# Altium schematic sheet TESTBAG.SchDoc: Automatic Test Bag PCB
size 420 x 297 mm; Date: 26/05/2566; ApprovedBy: <?>; CheckedBy: <?>; CompanyName: ISON IMPORT-EXPORT COMPANY LIMITED; DrawnBy: KANTAPIT SRIVERAPOL; DocumentNumber: 1; Revision: D1; SheetNumber: 1; SheetTotal: 2; Size: A3; ISON_ModDesc1: Change PCB layout; ISON_ModDesc2: Fixed PCB Layout; ISON_Model: <?>; Time: 14.21
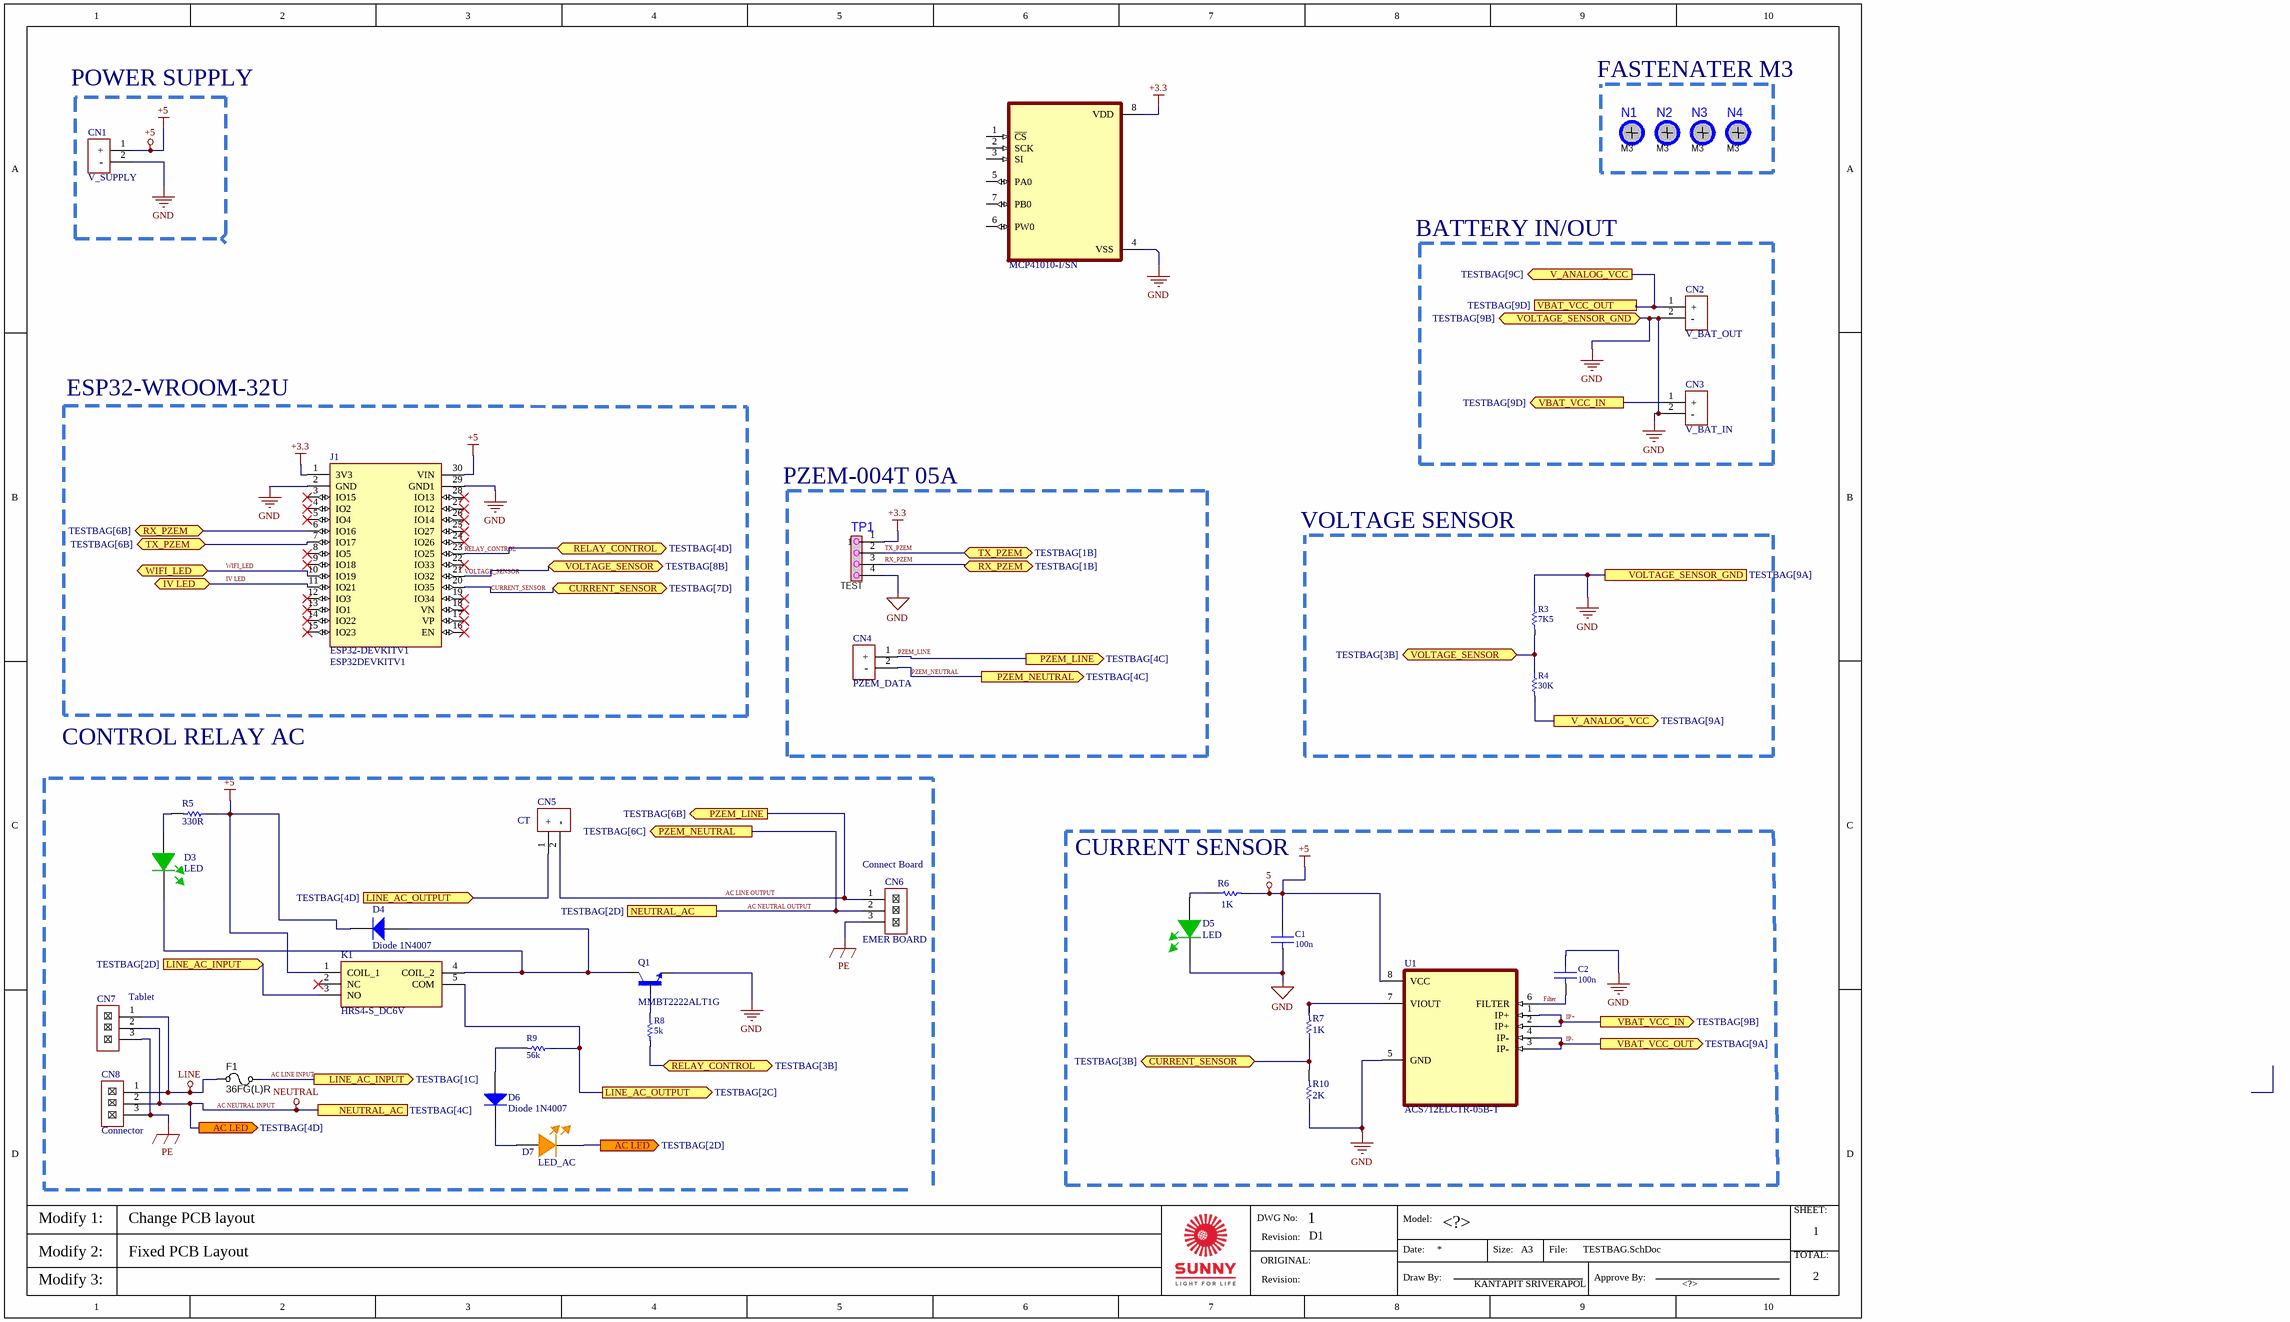
[diagram p0: TESTBAG.SchDoc]

## Parts
?  MCP41010-I/SN  [SOIC127P599X175-8N]
C1  100n  [CAPC2012X135N]
C2  100n  [CAPC2012X135N]
CN1  V_SUPPLY  [Header 2 pin molex]
CN2  V_BAT_OUT  [Header 2 pin molex]
CN3  V_BAT_IN  [Header 2 pin molex]
CN4  PZEM_DATA  [Header 2 pin molex]
CN5  CT  [Header 2 pin molex]
CN6  EMER BOARD  [CON 3P 3.8mm]
CN7  Tablet  [CON 3P 3.8mm]
CN8  Connector  [CON 3P 3.8mm]
D3  LED  [LED GREEN]
D4  Diode 1N4007  [DO-41]
D5  LED  [LED GREEN]
D6  Diode 1N4007  [DO-41]
D7  LED_AC  [LED ORANGE]
F1  36FG(L)R  [Micro Fuse - L14mm]
J1  ESP32DEVKITV1  [ESP32-DEVKITV1_3D]
K1  HRS4-S_DC6V  [HRS4SDC5V]
N1  M3  [M3 hole]
N2  M3  [M3 hole]
N3  M3  [M3 hole]
N4  M3  [M3 hole]
Q1  MMBT2222ALT1G  [SOT95P237X111-3N]
R3  7K5  [0805 MODIFICADO]
R4  30K  [0805 MODIFICADO]
R5  330R  [0805 Modificado]
R6  1K  [0805 Modificado]
R7  1K  [0805 Modificado]
R8  5k  [0805 MODIFICADO]
R9  56k  [RESC2012X60N]
R10  2K  [0805 Modificado]
TP1  TEST  [1x4P Test PIN]
U1  ACS712ELCTR-05B-T  [SOIC127P600X175-8N]

## Blocks framed on the sheet
ESP32-WROOM-32U: J1
CURRENT SENSOR: C1 C2 D5 R6 R7 R10 U1

## Ports
AC LED (out, see TESTBAG[2D]), AC LED (out, see TESTBAG[4D]), CURRENT_SENSOR (bidir, see TESTBAG[3B]), CURRENT_SENSOR (bidir, see TESTBAG[7D]), IV LED (bidir), LINE_AC_INPUT (in, see TESTBAG[2D]), LINE_AC_INPUT (out, see TESTBAG[1C]), LINE_AC_OUTPUT (in, see TESTBAG[4D]), LINE_AC_OUTPUT (out, see TESTBAG[2C]), NEUTRAL_AC (see TESTBAG[2D]), NEUTRAL_AC (see TESTBAG[4C]), PZEM_LINE (out, see TESTBAG[4C]), PZEM_LINE (out, see TESTBAG[6B]), PZEM_NEUTRAL (out, see TESTBAG[4C]), PZEM_NEUTRAL (out, see TESTBAG[6C]), RELAY_CONTROL (bidir, see TESTBAG[3B]), RELAY_CONTROL (bidir, see TESTBAG[4D]), RX_PZEM (bidir, see TESTBAG[1B]), RX_PZEM (bidir, see TESTBAG[6B]), TX_PZEM (bidir, see TESTBAG[1B]), TX_PZEM (bidir, see TESTBAG[6B]), V_ANALOG_VCC (out, see TESTBAG[9A]), V_ANALOG_VCC (out, see TESTBAG[9C]), VBAT_VCC_IN (out, see TESTBAG[9B]), VBAT_VCC_IN (out, see TESTBAG[9D]), VBAT_VCC_OUT (out, see TESTBAG[9A]), VBAT_VCC_OUT (see TESTBAG[9D]), VOLTAGE_SENSOR (bidir, see TESTBAG[3B]), VOLTAGE_SENSOR (bidir, see TESTBAG[8B]), VOLTAGE_SENSOR_GND (bidir, see TESTBAG[9B]), VOLTAGE_SENSOR_GND (see TESTBAG[9A]), WIFI_LED (bidir)

## Nets
+3.3: ?.8(VDD) J1.1(3V3) TP1.1
+5: C1.2 CN1.1(+) D4.2(K) J1.30(VIN) K1.1(COIL_1) R5.1 R6.1 U1.8(VCC)  [also labelled 5]
AC NEUTRAL INPUT: CN4.2(-) CN6.2 CN7.2 CN8.2 D7.1(K) ; port NEUTRAL_AC, port PZEM_NEUTRAL, port AC LED  [also labelled AC NEUTRAL OUTPUT, NEUTRAL, PZEM_NEUTRAL]
GND: ?.4(VSS) C1.1 C2.2 CN1.2(-) CN2.2(-) CN3.2(-) D5.1(K) J1.2(GND) J1.29(GND1) Q1.2(E) R3.2 R10.1 TP1.4 U1.5(GND) ; port VOLTAGE_SENSOR_GND
LINE: CN7.1 CN8.1 F1.1
PE: CN6.3 CN7.3 CN8.3
AC LINE INPUT: F1.2 K1.3(NO) ; port LINE_AC_INPUT
AC LINE OUTPUT: CN4.1(+) CN5.2(-) CN6.1 ; port PZEM_LINE  [also labelled PZEM_LINE]
CURRENT_SENSOR: J1.20(IO35) R7.1 R10.2 ; port CURRENT_SENSOR
Filter: C2.1 U1.6(FILTER)
IP+: CN3.1(+) U1.1(IP+) U1.2(IP+) ; port VBAT_VCC_IN
IP-: CN2.1(+) R4.1 U1.3(IP-) U1.4(IP-) ; port VBAT_VCC_OUT, port V_ANALOG_VCC
IV LED: J1.11(IO21) ; port IV LED
LINE_AC_OUTPUT: CN5.1(+) K1.5(COM) R9.1 ; port LINE_AC_OUTPUT
RELAY_CONTROL: J1.23(IO25) R8.1 ; port RELAY_CONTROL
RX_PZEM: J1.6(IO16) TP1.3 ; port RX_PZEM
TX_PZEM: J1.7(IO17) TP1.2 ; port TX_PZEM
VOLTAGE_SENSOR: J1.21(IO32) R3.1 R4.2 ; port VOLTAGE_SENSOR
WIFI_LED: J1.10(IO19) ; port WIFI_LED
NetD3_1: D3.1(K) D4.1(A) K1.4(COIL_2) Q1.3(C)
NetD3_2: D3.2(A) R5.2
NetD5_2: D5.2(A) R6.2
NetD6_1: D6.1(A) R9.2
NetD6_2: D6.2(K) D7.2(A)
NetQ1_1: Q1.1(B) R8.2
NetR7_2: R7.2 U1.7(VIOUT)

Not connected (* = marked no-connect by the designer): ? 1(~{CS}) 2(SCK) 3(SI) 5(PA0) 6(PW0) 7(PB0); J1 3(IO15)* 4(IO2)* 5(IO4)* 8(IO5)* 9(IO18)* 12(IO3)* 13(IO1)* 14(IO22)* 15(IO23)* 16(EN)* 17(VP)* 18(VN)* 19(IO34)* 22(IO33)* 24(IO26)* 25(IO27)* 26(IO14)* 27(IO12)* 28(IO13)*; K1 2(NC)*

## Notes on the sheet
- POWER SUPPLY
- FASTENATER M3
- BATTERY IN/OUT
- PZEM-004T 05A
- VOLTAGE SENSOR
- CONTROL RELAY AC
- (near CN6) Connect Board
- Modify 1:
- DWG No:
- Model:
- SHEET:
- Modify 2:
- ORIGINAL:
- Revision:
- Date:
- Draw By:
- Size:
- File:
- Approve By:
- TOTAL:
- Modify 3:
- (in symbol ESP32DEVKITV1) ESP32-DEVKITV1

## Library data of the parts
? = MCP41010-I/SN: Digital Potentiometer 10k Ohm 1 Circuit 256 Taps SPI Interface 8-SOIC; MF: Microchip; Availability: Unavailable; MP: MCP41010-I/SN; Package: SOIC-8 Microchip; SnapEDA_Link: https://www.snapeda.com/parts/MCP41010-I/SN/Microchip/view-part/43921/?ref=snap; Value: *; Price: None
CN1-CN5 = Header LIGHT: Connector 3.96MM 02 PIN WAFER STRAIGHTPIN (MALE)
CN6-CN8 = Con 112002ST/RH 3.96mm 2P V-PLUG_1: Connector 3.9mm. 3PINS WAFER STRAIGHT PIN (MALE); RMPN: RMELCCNT006; Manufacturer: GTK; RM DESC: Connector 3.9mm. 2PINS WAFER STRAIGHT PIN (MALE); ESPN: 0007-0932-2; M DESC: WAFER Connector 2 Pins,Pitch 3.96mm, Straight Type; MPN: 112002ST/RH; ComponentLink1Description: ES LINK; ComponentLink1URL: https://www.es.co.th/detail.asp?Prod=000709322
D3 D5 = LED GREEN: LED Lamp Round 5 mm, 50 mcd,Green Color Green Diffused Lens
D4 D6 = Diode 1N4001: 1 Amp General Purpose Rectifier; Published: 8-Jun-2000; LatestRevisionDate: 17-Jul-2002; LatestRevisionNote: Re-released for DXP Platform.; DatasheetVersion: 1998; PackageVersion: Aug-1999; PackageReference: DO-41; Publisher: Altium Limited; PackageDescription: Diode, Axial; Body 5.2 x 2.7 mm (LxDia. max), Lead Dia. 0.86 mm (max); Code_JEDEC: DO-204-AL; ComponentLink1Description: Manufacturer Link; ComponentLink1URL: http://www.fairchildsemi.com/; ComponentLink2Description: Datasheet; ComponentLink2URL: http://www.fairchildsemi.com/ds/1N%2F1N4001.pdf
D7 = LED ORANGE: LED ORANGE for AC-signal display
F1 = Fuse 36FG(L)R 1A On pcb: Fuse Microfuse, 1A/250Vac, Fast Acting (Normal Blow) P/N : 36FG(L)R (SLEEK); RMPN: RMELCFUSA001; Revised: Zion Blue; RM DESC: Fuse หางหนู Microfuse, 1A/250Vac, Fast Acting (Normal Blow) P/N : 36FG(L)R (SLEEK); ESPN: 0562-0001-0; Value: 1A, 250Vac; Published: 14-May-2014; Publisher: Cynetik Group; MPN: 36FG(L)R; Manufacturer: SLEEK; ComponentLink1Description: Link ES; ComponentLink1URL: https://www.es.co.th/detail.asp?prod=056200010; ComponentLink2Description: Datasheet; ComponentLink2URL: https://www.es.co.th/Schemetic/PDF/36FG-SLEEK.PDF
J1 = ESP32DEVKITV1: Dual core, Wi-Fi: 2.4 GHz up to 150 Mbits/s,BLE (Bluetooth Low Energy) and legacy Bluetooth, 32 bits, Up to 240 MHz; MF: Do it; Check_prices: https://www.snapeda.com/parts/ESP32%20DEVKIT%20V1/Do%20it/view-part/5659245/?ref=eda; Value: *; SnapEDA_Link: https://www.snapeda.com/parts/ESP32%20DEVKIT%20V1/Do%20it/view-part/5659245/?ref=snap; Package: Package; Availability: Unavailable; Price: None; MP: ESP32 DEVKIT V1
K1 = HRS4-S_DC5V: Relay or Contactor; Manufacturer_Name: MULTICOMP; Manufacturer_Part_Number: HRS4-S DC5V; Datasheet Link: http://www.farnell.com/datasheets/1306711.pdf; Height: 16mm
N1-N4 = M3 hole: น็อต JT หัวร่ม สกรูมิลสี่แฉก M3x6; RMPN: RMRMANUTCJTZ011
Q1 = MMBT2222ALT1G: Bipolar (BJT) Transistor NPN 40 V 600 mA 300MHz 225 mW Surface Mount SOT-23-3 (TO-236); MF: ON Semiconductor; SnapEDA_Link: https://www.snapeda.com/parts/MMBT2222ALT1G/Onsemi/view-part/?ref=snap; Purchase-URL: https://pricing.snapeda.com/search/part/MMBT2222ALT1G/?ref=eda; MP: MMBT2222ALT1G; Check_prices: https://www.snapeda.com/parts/MMBT2222ALT1G/Onsemi/view-part/?ref=eda; Availability: In Stock; Package: SOT-23-3 ON Semiconductor; Price: None; Value: *
R3 R4 R9 = 5k
R5 = Resistor SMD 330R +/- 1% (CHIP): 'RES SMD 330 OHM 5% 1/8W 0805/0805W8F3300T5E; RMPN: RMELCRSTS010
R6 R7 = Resistor 0805 SMD 1K OHM +/- 1% (CHIP): 'RES SMD 1K OHM 1% 1/8W 0805/0805W8F1001T5E
R10 = Resistor 0805 SMD 4K7 OHM +/- 1% (CHIP): 'RES SMD 4.7K OHM 1% 1/8W 0805/0805W8F4701T5E
TP1 = PIN Header 1X4: Connector Pin Header 4 Pins,Pitch 2.54mm. P/N : PHSS04G10/RH (GTK); ComponentLink1Description: Link ES; ComponentLink1URL: https://www.es.co.th/detail.asp?Prod=000703471; ComponentLink2Description: Datasheet; ComponentLink2URL: https://www.es.co.th/Schemetic/PDF/PHSSXXG10.PDF
U1 = ACS712ELCTR-05B-T: Current Sensor 5A 1 Channel Hall Effect, Open Loop Bidirectional 8-SOIC (0.154, 3.90mm Width); MF: Allegro MicroSystems LLC; SnapEDA_Link: https://www.snapeda.com/parts/ACS712ELCTR-05B-T/Allegro+MicroSystems+LLC/view-part/?ref=snap; Package: SOIC-8 Allegro MicroSystems LLC; MP: ACS712ELCTR-05B-T; Check_prices: https://www.snapeda.com/parts/ACS712ELCTR-05B-T/Allegro+MicroSystems+LLC/view-part/?ref=eda; Purchase-URL: https://pricing.snapeda.com/search/part/ACS712ELCTR-05B-T/?ref=eda; Price: None; Value: *; Availability: In Stock